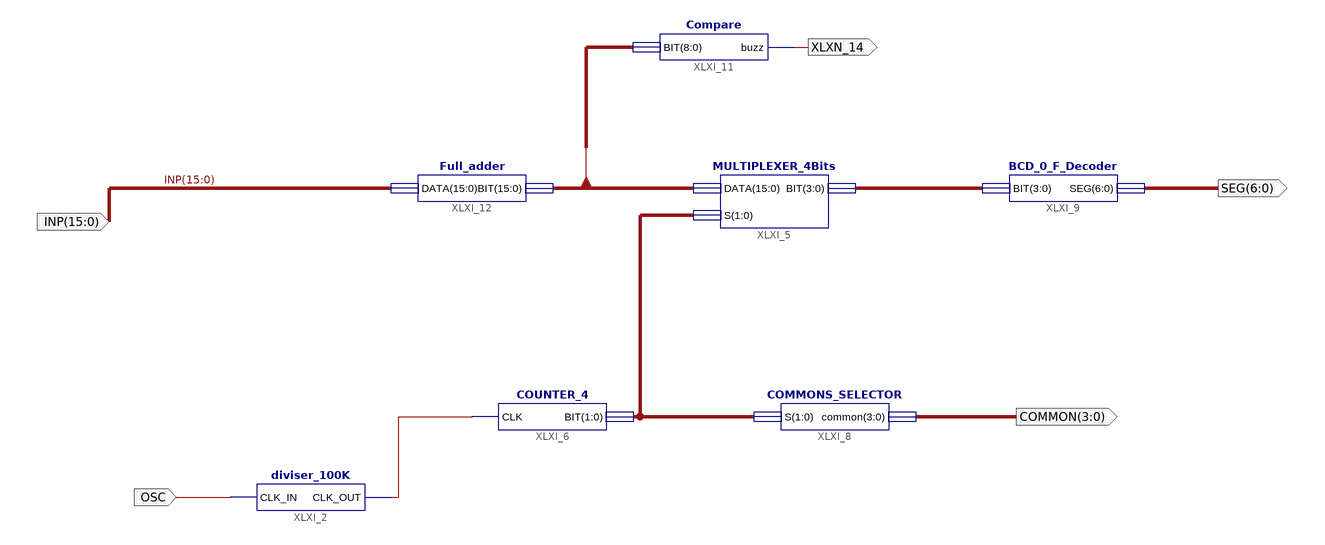
[diagram p0: schematic sheet 1]
// Xilinx ISE schematic add.sch (spartan6) as structural Verilog: 7 symbols, 5 ports
module add (
  input  OSC,
  input  [15:0] INP,
  output [3:0] COMMON,
  output [6:0] SEG,
  output XLXN_14
);

  wire XLXN_5;
  wire [1:0] XLXN_6;
  wire [3:0] XLXN_12;
  wire [15:0] BIT;

  diviser_100K XLXI_2 (.CLK_IN(OSC), .CLK_OUT(XLXN_5));
  COUNTER_4 XLXI_6 (.BIT(XLXN_6), .CLK(XLXN_5));
  MULTIPLEXER_4Bits XLXI_5 (.BIT(XLXN_12), .DATA(BIT), .S(XLXN_6));
  BCD_0_F_Decoder XLXI_9 (.BIT(XLXN_12), .SEG(SEG));
  COMMONS_SELECTOR XLXI_8 (.common(COMMON), .S(XLXN_6));
  Compare XLXI_11 (.BIT(BIT[8:0]), .buzz(XLXN_14));
  Full_adder XLXI_12 (.BIT(BIT), .DATA(INP));

  // Notes on the sheet:
  //   LOC on signal OSC = P123
  //   LOC on signal XLXN_14 = P83
endmodule
